# Altium schematic sheet Digital Isolation.SchDoc
size A4
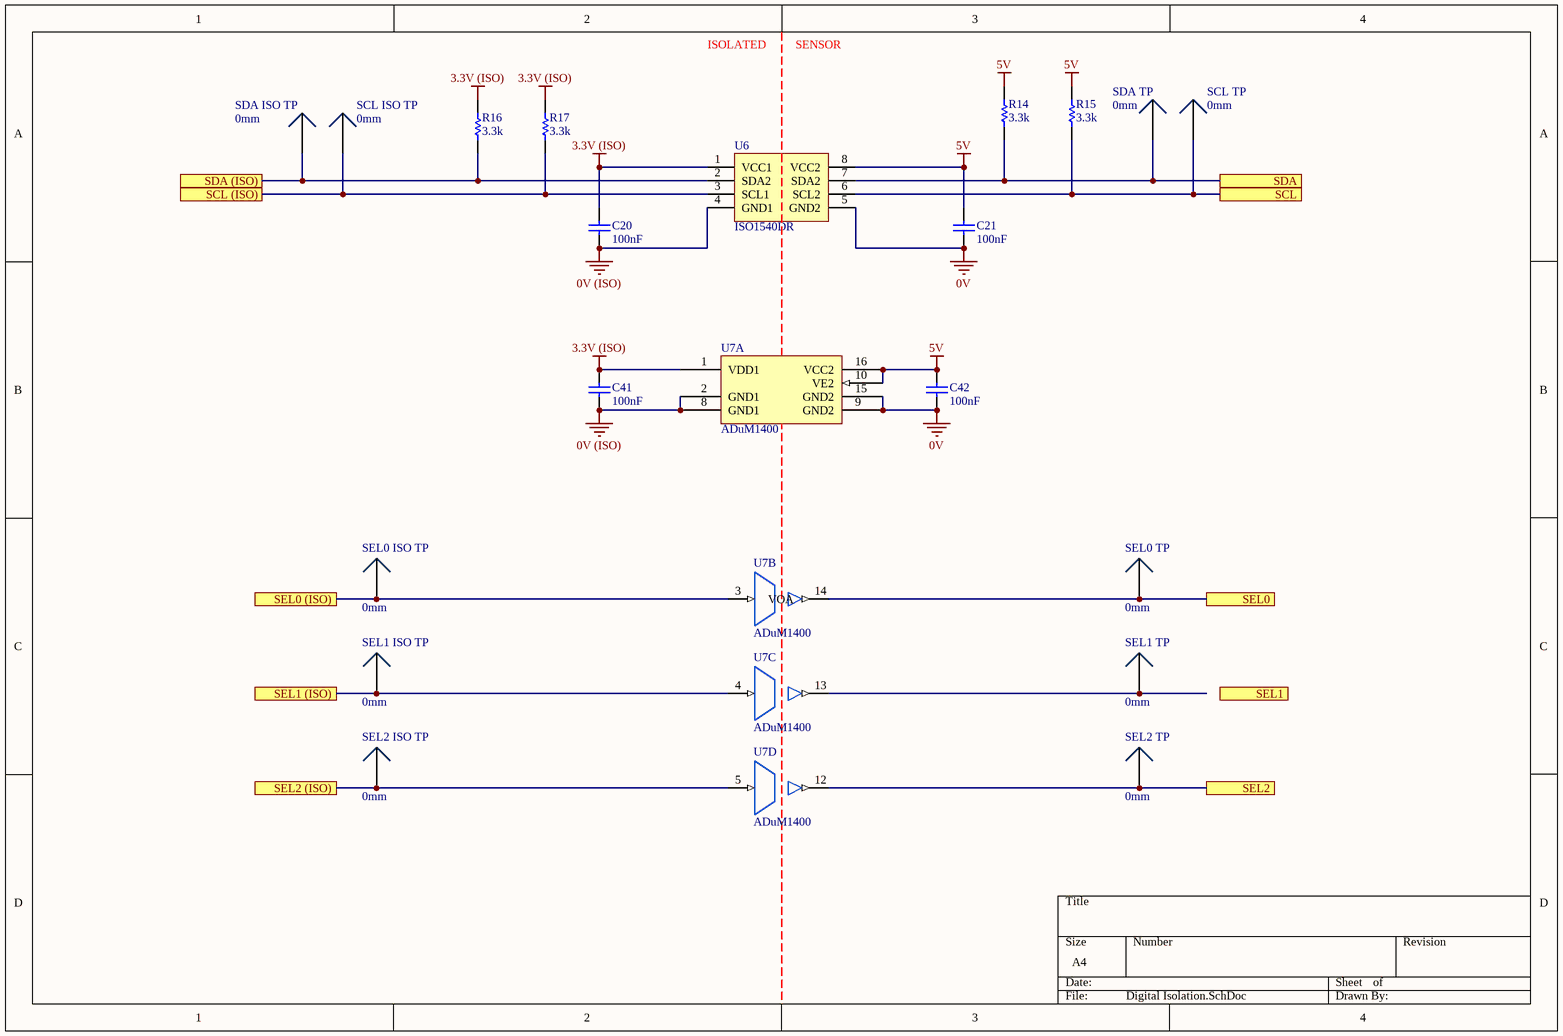
[diagram p0: Digital Isolation.SchDoc]

## Parts
C20  100nF  [0805]
C21  100nF  [0805]
C41  100nF  [0805]
C42  100nF  [0805]
R14  3.3k  [0805]
R15  3.3k  [0805]
R16  3.3k  [0805]
R17  3.3k  [0805]
SCL_ISO_TP  0mm  [SMD Test Point]
SCL_TP  0mm  [SMD Test Point]
SDA_ISO_TP  0mm  [SMD Test Point]
SDA_TP  0mm  [SMD Test Point]
SEL0_ISO_TP  0mm  [SMD Test Point]
SEL0_TP  0mm  [SMD Test Point]
SEL1_ISO_TP  0mm  [SMD Test Point]
SEL1_TP  0mm  [SMD Test Point]
SEL2_ISO_TP  0mm  [SMD Test Point]
SEL2_TP  0mm  [SMD Test Point]
U6  ISO1540DR  [TI 8-SOIC]
U7  ADuM1400  [AD 16-SOIC]  (parts A,B,C,D of 5)

## Ports
SCL, SCL (ISO), SDA, SDA (ISO), SEL0, SEL0 (ISO), SEL1, SEL1 (ISO), SEL2, SEL2 (ISO)

## Nets
0V: C21.1 C42.1 U6.5(GND2) U7.9(GND2) U7.15(GND2)
0V (ISO): C20.1 C41.1 U6.4(GND1) U7.2(GND1) U7.8(GND1)
3.3V (ISO): C20.2 C41.2 R16.2 R17.2 U6.1(VCC1) U7.1(VDD1)
5V: C21.2 C42.2 R14.2 R15.2 U6.8(VCC2) U7.10(VE2) U7.16(VCC2)
SCL: R15.1 SCL_TP.1 U6.6(SCL2) ; port SCL
SCL (ISO): R17.1 SCL_ISO_TP.1 U6.3(SCL1) ; port SCL (ISO)
SDA: R14.1 SDA_TP.1 U6.7(SDA2) ; port SDA
SDA (ISO): R16.1 SDA_ISO_TP.1 U6.2(SDA2) ; port SDA (ISO)
SEL0: SEL0_TP.1 U7.14(VOA) ; port SEL0
SEL0 (ISO): SEL0_ISO_TP.1 U7.3(VIA) ; port SEL0 (ISO)
SEL1 (ISO): SEL1_ISO_TP.1 U7.4(VIB) ; port SEL1 (ISO)
SEL2: SEL2_TP.1 U7.12(VOC) ; port SEL2
SEL2 (ISO): SEL2_ISO_TP.1 U7.5(VIC) ; port SEL2 (ISO)
NetSEL1_TP_1: SEL1_TP.1 U7.13(VOB)

## Notes on the sheet
- ISOLATED
- SENSOR

## Library data of the parts
C20 C21 = GCM21BR71E104KA37L: Manufacturer: muRata; Tolerance: 10%; Material: X7R; Rated Voltage: 25V; Part Number: GCM21BR71E104KA37L; Value: 100nF
C41 C42 = GCM21BR71H104KA37L: Manufacturer: muRata; Tolerance: ±10%; Material: X7R; Rated Voltage: 50V; Part Number: GCM21BR71H104KA37L; Value: 100nF; Digikey Part Number: 490-6064-1-ND
R14-R17 = RC0805FR073K3L: Manufacturer: YAGEO; Tolerance: 0.01; Rated Voltage: 0.125W; Part Number: RC0805FR073K3L; Value: 3.3k; Material: FR-07
SCL_ISO_TP SCL_TP SDA_ISO_TP SDA_TP SEL0_ISO_TP SEL0_TP SEL1_ISO_TP SEL1_TP SEL2_ISO_TP SEL2_TP = SMD Test Point: Positions: 1; Row Spacing: 0; Flange: No; Contact: NA; Part Number: SMD Test Point; Pitch: 0mm; Angle: 0
U6 = ISO1540DR: I2C Digital Isolator (Multichannel); Manufacturer: Texas Instruments; Part Number: ISO1540DR; Digikey Part Number: 296-34871-1-ND; Digikey Link: https://www.digikey.com/product-detail/en/texas-instruments/ISO1540DR/296-34871-1-ND/3587214
U7 = ADuM1400: General Purpose Digital Isolator 2500Vrms 4 Channel 1Mbps 25kV/µs CMTI 16-SOIC (0.295", 7.50mm Width); Manufacturer: Analog Devices; Part Number: ADuM1400; Digikey Part Number: ADUM1400WSRWZ-ND; Digikey Link: https://www.digikey.com/product-detail/en/analog-devices-inc/ADUM1400WSRWZ/ADUM1400WSRWZ-ND/1873713